# Altium project Banka.PrjPcb
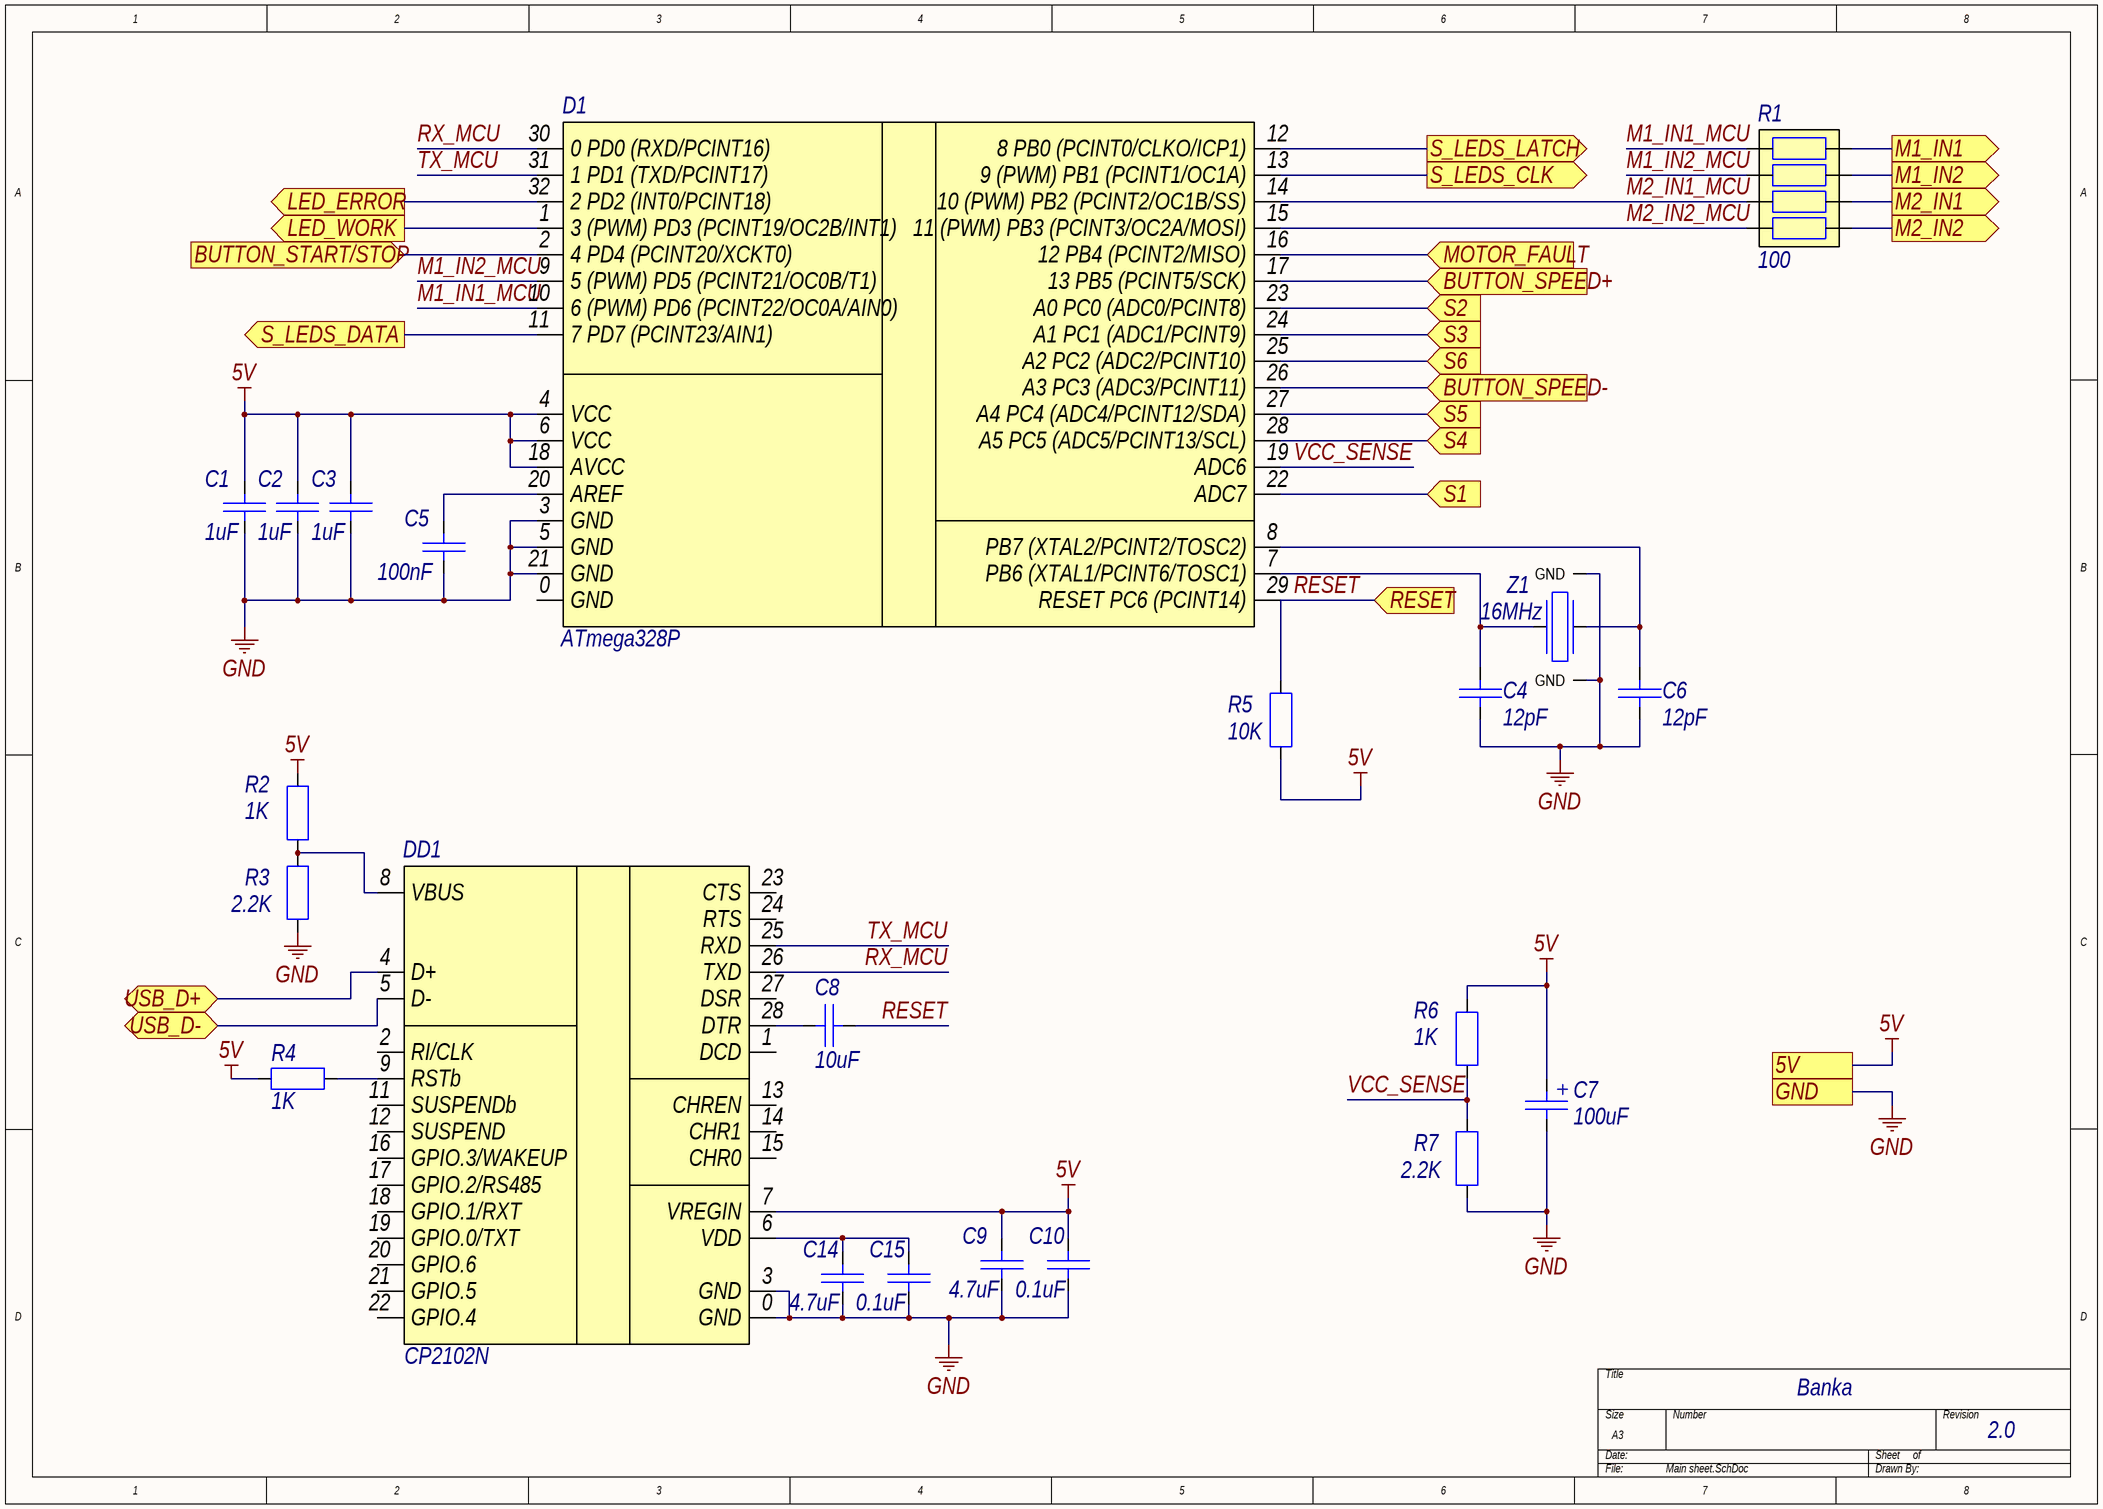
[diagram p0: Main sheet.SchDoc]
4 sheets, 87 parts. Net scope: flat (ports and power ports of the same name join across sheets).
Board file: Banka.PcbDoc
Sheets:
  Main sheet.SchDoc
  IO.SchDoc
  Sensors.SchDoc
  Motor driver.SchDoc

## Sheet Main sheet.SchDoc
size A3

### Parts
C1  1uF  [NPC0805]
C2  1uF  [NPC0805]
C3  1uF  [NPC0805]
C4  12pF  [NPC0805]
C5  100nF  [NPC0805]
C6  12pF  [NPC0805]
C7  100uF  [TANTAL CAPACITOR C]
C8  10uF  [NPC0805]
C9  4.7uF  [NPC0805]
C10  0.1uF  [NPC0805]
C14  4.7uF  [NPC0805]
C15  0.1uF  [NPC0805]
D1  ATmega328P  [TQFP32]
DD1  CP2102N  [QFN28 (5x5)]
R1  100  [CAT16]
R2  1K  [R0805]
R3  2.2K  [R0805]
R4  1K  [R0805]
R5  10K  [R0805]
R6  1K  [R0805]
R7  2.2K  [R0805]
Z1  16MHz  [KX-7T]

### Ports
5V, BUTTON_SPEED+ (in), BUTTON_SPEED- (in), BUTTON_START/STOP (in), GND, LED_ERROR (out), LED_WORK (out), M1_IN1 (out), M1_IN2 (out), M2_IN1 (out), M2_IN2 (out), MOTOR_FAULT (in), RESET (in), S1 (in), S2 (in), S3 (in), S4 (in), S5 (in), S6 (in), S_LEDS_CLK (out), S_LEDS_DATA (out), S_LEDS_LATCH (out), USB_D+ (bidir), USB_D- (bidir)

### Nets
5V: C1.2 C2.2 C3.2 C7.1 C9.2 C10.2 D1.4(VCC) D1.6(VCC) D1.18(AVCC) DD1.7(VREGIN) R2.2 R4.2 R5.1 R6.2 ; port 5V
GND: C1.1 C2.1 C3.1 C4.1 C5.1 C6.1 C7.2 C9.1 C10.1 C14.1 C15.1 D1.3(GND) D1.5(GND) D1.21(GND) DD1.0(GND) DD1.3(GND) R3.1 R7.1 Z1.3(GND) Z1.4(GND) ; port GND
BUTTON_SPEED+: D1.17(13_PB5_(PCINT5/SCK)) ; port BUTTON_SPEED+
BUTTON_SPEED-: D1.26(A3_PC3_(ADC3/PCINT11)) ; port BUTTON_SPEED-
BUTTON_START/STOP: D1.2(4_PD4_(PCINT20/XCKT0)) ; port BUTTON_START/STOP
LED_ERROR: D1.32(2_PD2_(INT0/PCINT18)) ; port LED_ERROR
LED_WORK: D1.1(3_(PWM)_PD3_(PCINT19/OC2B/INT1)) ; port LED_WORK
M1_IN1: R1.4 ; port M1_IN1
M1_IN1_MCU: D1.10(6_(PWM)_PD6_(PCINT22/OC0A/AIN0)) R1.5
M1_IN2: R1.3 ; port M1_IN2
M1_IN2_MCU: D1.9(5_(PWM)_PD5_(PCINT21/OC0B/T1)) R1.6
M2_IN1: R1.2 ; port M2_IN1
M2_IN1_MCU: D1.14(10_(PWM)_PB2_(PCINT2/OC1B/SS)) R1.7
M2_IN2: R1.1 ; port M2_IN2
M2_IN2_MCU: D1.15(11_(PWM)_PB3_(PCINT3/OC2A/MOSI)) R1.8
MOTOR_FAULT: D1.16(12_PB4_(PCINT2/MISO)) ; port MOTOR_FAULT
RESET: C8.1 D1.29(RESET_PC6_(PCINT14)) R5.2 ; port RESET
RX_MCU: D1.30(0_PD0_(RXD/PCINT16)) DD1.26(TXD)
S1: D1.22(ADC7) ; port S1
S2: D1.23(A0_PC0_(ADC0/PCINT8)) ; port S2
S3: D1.24(A1_PC1_(ADC1/PCINT9)) ; port S3
S4: D1.28(A5_PC5_(ADC5/PCINT13/SCL)) ; port S4
S5: D1.27(A4_PC4_(ADC4/PCINT12/SDA)) ; port S5
S6: D1.25(A2_PC2_(ADC2/PCINT10)) ; port S6
S_LEDS_CLK: D1.13(9_(PWM)_PB1_(PCINT1/OC1A)) ; port S_LEDS_CLK
S_LEDS_DATA: D1.11(7_PD7_(PCINT23/AIN1)) ; port S_LEDS_DATA
S_LEDS_LATCH: D1.12(8_PB0_(PCINT0/CLKO/ICP1)) ; port S_LEDS_LATCH
TX_MCU: D1.31(1_PD1_(TXD/PCINT17)) DD1.25(RXD)
USB_D+: DD1.4(D+) ; port USB_D+
USB_D-: DD1.5(D-) ; port USB_D-
VCC_SENSE: D1.19(ADC6) R6.1 R7.2
NetC4_2: C4.2 D1.7(PB6_(XTAL1/PCINT6/TOSC1)) Z1.1
NetC5_2: C5.2 D1.20(AREF)
NetC6_2: C6.2 D1.8(PB7_(XTAL2/PCINT2/TOSC2)) Z1.2
NetC8_2: C8.2 DD1.28(DTR)
NetC14_2: C14.2 C15.2 DD1.6(VDD)
NetDD1_8: DD1.8(VBUS) R2.1 R3.2
NetDD1_9: DD1.9(RSTb) R4.1

Not connected (* = marked no-connect by the designer): D1 0(GND); DD1 1(DCD) 2(RI/CLK) 11(SUSPENDb) 12(SUSPEND) 13(CHREN) 14(CHR1) 15(CHR0) 16(GPIO.3/WAKEUP) 17(GPIO.2/RS485) 18(GPIO.1/RXT) 19(GPIO.0/TXT) 20(GPIO.6) 21(GPIO.5) 22(GPIO.4) 23(CTS) 24(RTS) 27(DSR)

### Notes on the sheet
- Banka
- 2.0

### Library data of the parts
C1-C6 C8-C10 C14 C15 = Nonpolarized Capacitor: Nonpolarized Capacitor (Ceramic)
  C1-C3: Value: 1uF
  C4 C6: Value: 12pF
  C5: Value: 100nF
  C8: Value: 10uF
  C9 C14: Value: 4.7uF
  C10 C15: Value: 0.1uF
C7 = Polarized Capacitor: Polarized Capacitor (Electrolytic, tantalum); Value: 100uF
D1 = ATmega328P: AVR, 8-bit MCU, 20MHz, 32KB Flash
DD1 = CP2102N 28 pin: USB-UART converter
R1 = Resistor Array: Power rating: 0,05Вт; Value: 100
R2-R7 = Resistor: Power rating: 2Вт
  R2 R4 R6: Value: 1K
  R3 R7: Value: 2.2K
  R5: Value: 10K
Z1 = Quartz Crystal: Quartz oscillator; Manufacturer: Geyer Electronics; Tolerance: 30ppm; Temperature tolerance: 100ppm; Max. aging frequency at first year: +-2ppm; Name: KX-7T; Temperature range: -40...85C; Value: 16MHz; Package: SMD3,2x2,5x0,8

## Sheet IO.SchDoc
size A3
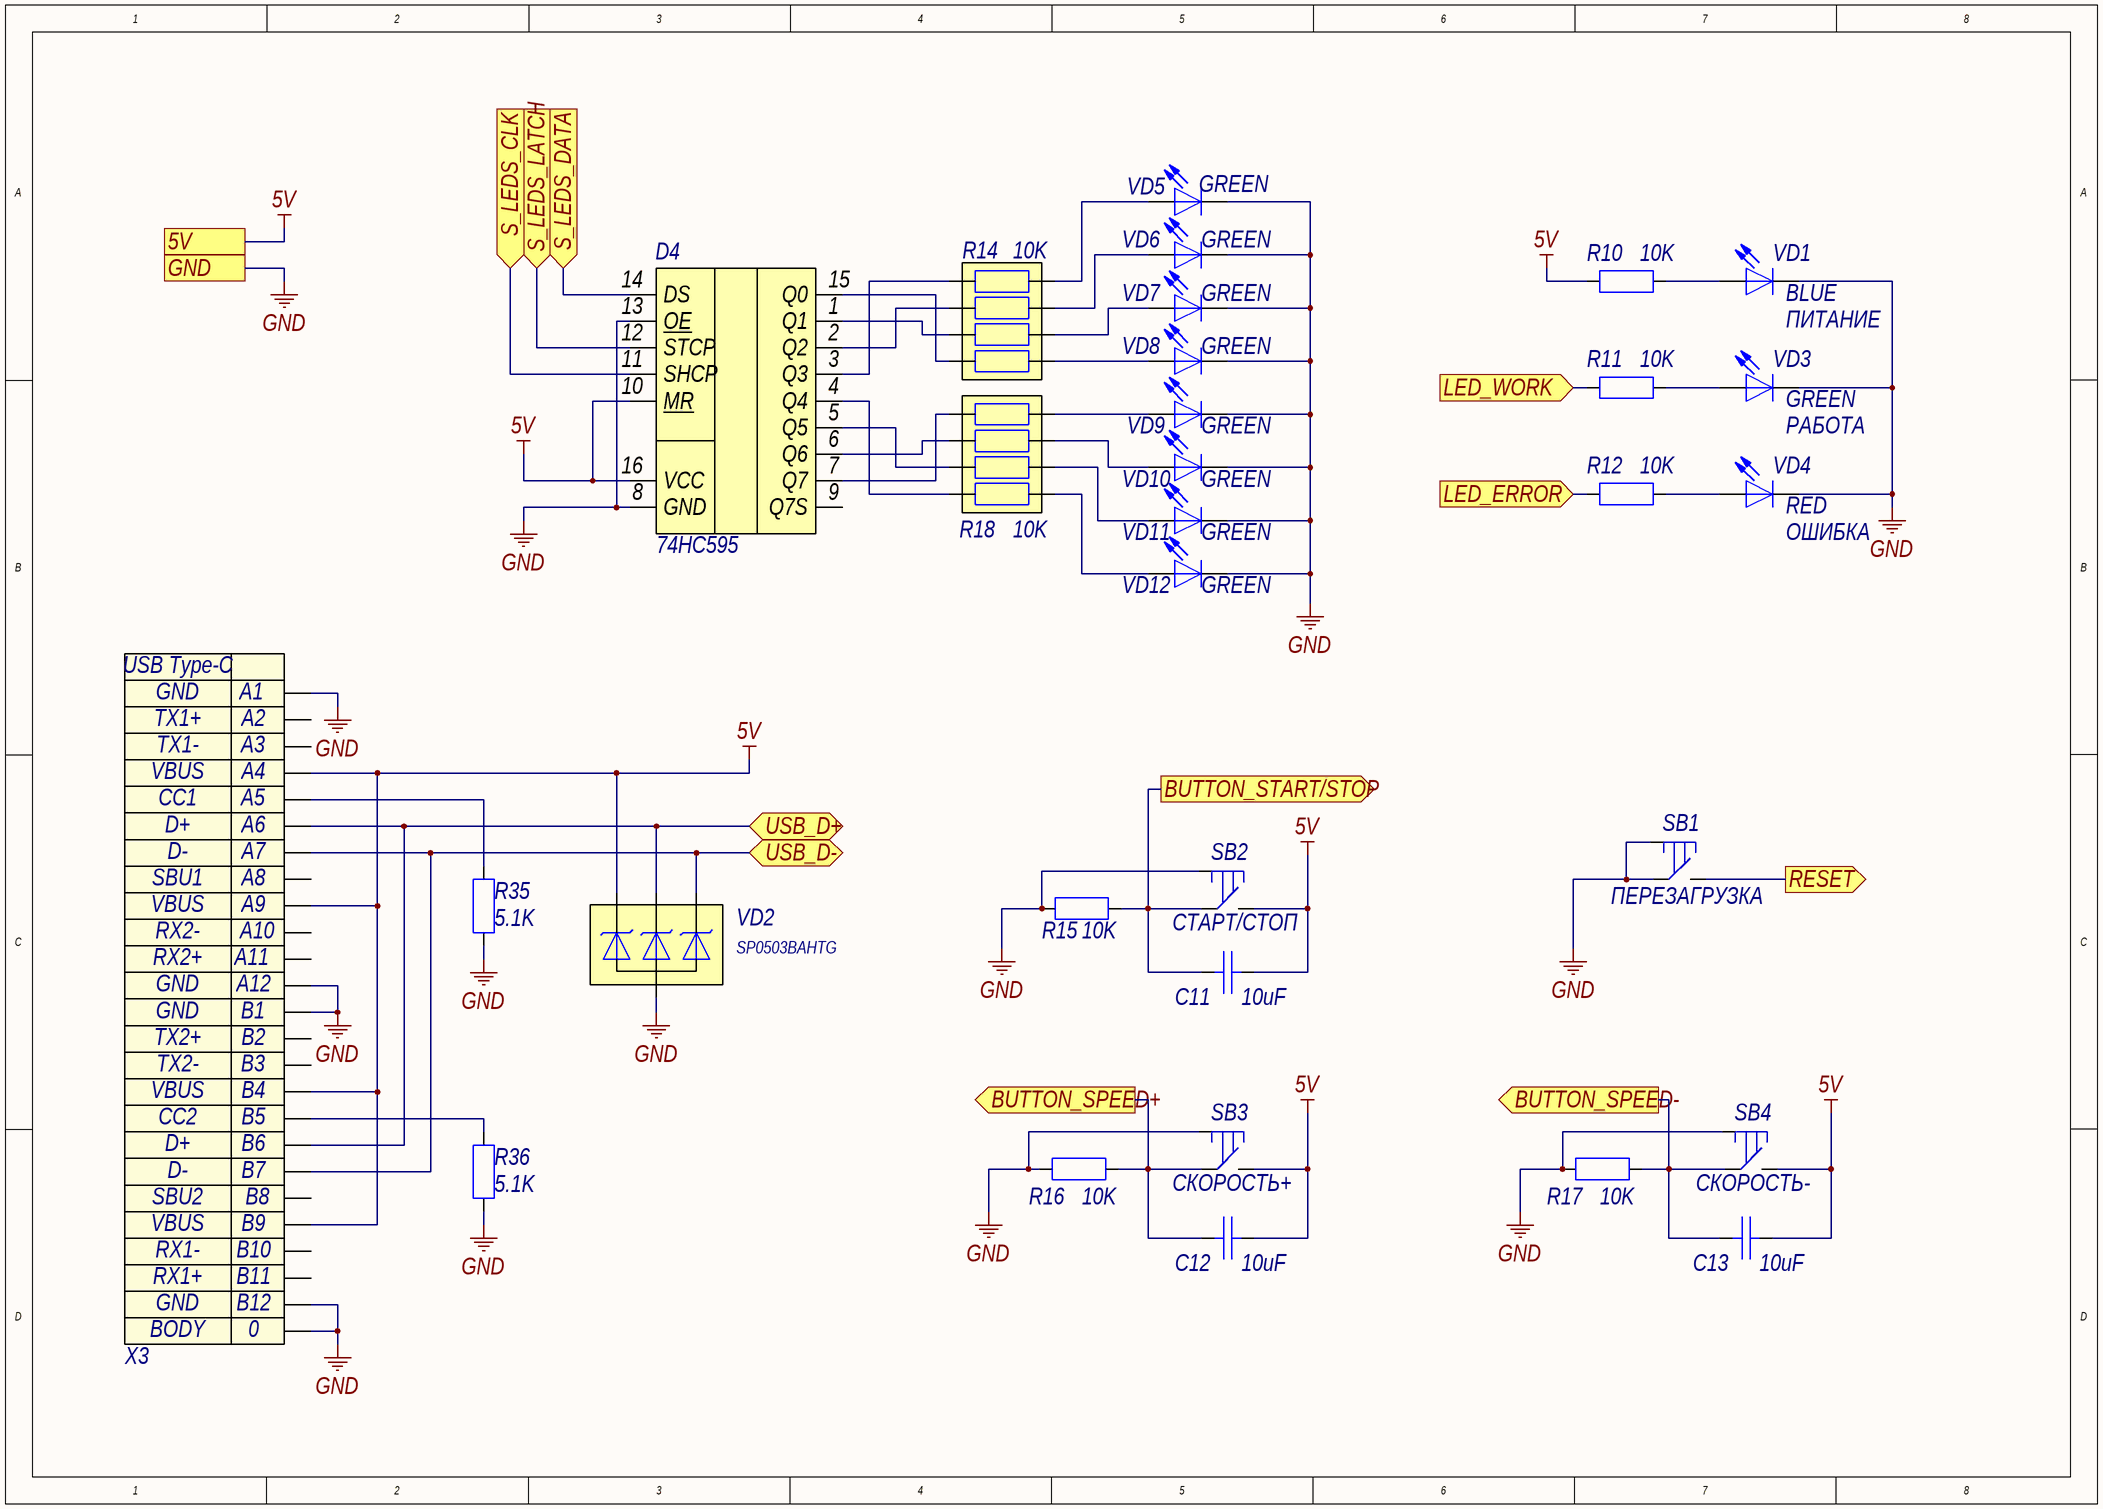
[diagram p1: IO.SchDoc]

### Parts
C11  10uF  [NPC0805]
C12  10uF  [NPC0805]
C13  10uF  [NPC0805]
D4  74HC595  [SOIC16]
R10  10K  [R0805]
R11  10K  [R0805]
R12  10K  [R0805]
R14  10K  [CAT16]
R15  10K  [R0805]
R16  10K  [R0805]
R17  10K  [R0805]
R18  10K  [CAT16]
R35  5.1K  [R0805]
R36  5.1K  [R0805]
SB1  Function: ПЕРЕЗАГРУЗКА  [1-1437565-6 WITH LABEL]
SB2  Function: СТАРТ/СТОП  [1-1437565-6 WITH LABEL]
SB3  Function: СКОРОСТЬ+  [1-1437565-6 WITH LABEL]
SB4  Function: СКОРОСТЬ-  [1-1437565-6 WITH LABEL]
VD1  Name: ПИТАНИЕ  Color: BLUE  [0805_LED _BLUE]
VD2  SP0503BAHTG  [SOT143]
VD3  Name: РАБОТА  Color: GREEN  [0805_LED _GREEN]
VD4  Name: ОШИБКА  Color: RED  [0805_LED _RED]
VD5  GREEN  [0805_LED _GREEN]
VD6  Color: GREEN  [0805_LED _GREEN]
VD7  Color: GREEN  [0805_LED _GREEN]
VD8  Color: GREEN  [0805_LED _GREEN]
VD9  Color: GREEN  [0805_LED _GREEN]
VD10  Color: GREEN  [0805_LED _GREEN]
VD11  Color: GREEN  [0805_LED _GREEN]
VD12  Color: GREEN  [0805_LED _GREEN]
X3  USB Type-C  [USB Type-C Vertical]  (value not drawn)

### Ports
5V, BUTTON_SPEED+ (out), BUTTON_SPEED- (out), BUTTON_START/STOP (out), GND, LED_ERROR (in), LED_WORK (in), RESET (out), S_LEDS_CLK (in), S_LEDS_DATA (in), S_LEDS_LATCH (in), USB_D+ (bidir), USB_D- (bidir)

### Nets
5V: C11.2 C12.2 C13.2 D4.10(MR) D4.16(VCC) R10.1 SB2.2 SB3.2 SB4.2 VD2.2(C) X3.A4 X3.A9 X3.B4 X3.B9 ; port 5V
GND: D4.8(GND) D4.13(OE) R15.1 R16.1 R17.1 R35.1 R36.1 SB1.1 SB1.3(GND) SB2.3(GND) SB3.3(GND) SB4.3(GND) VD1.1(K) VD2.1(A) VD3.1(K) VD4.1(K) VD5.1(K) VD6.1(K) VD7.1(K) VD8.1(K) VD9.1(K) VD10.1(K) VD11.1(K) VD12.1(K) X3.0 X3.A1 X3.A12 X3.B1 X3.B12 ; port GND
BUTTON_SPEED+: C12.1 R16.2 SB3.1 ; port BUTTON_SPEED+
BUTTON_SPEED-: C13.1 R17.2 SB4.1 ; port BUTTON_SPEED-
BUTTON_START/STOP: C11.1 R15.2 SB2.1 ; port BUTTON_START/STOP
LED_ERROR: R12.1 ; port LED_ERROR
LED_WORK: R11.1 ; port LED_WORK
RESET: SB1.2 ; port RESET
S_LEDS_CLK: D4.11(SHCP) ; port S_LEDS_CLK
S_LEDS_DATA: D4.14(DS) ; port S_LEDS_DATA
S_LEDS_LATCH: D4.12(STCP) ; port S_LEDS_LATCH
USB_D+: VD2.3(C) X3.A6 X3.B6 ; port USB_D+
USB_D-: VD2.4(C) X3.A7 X3.B7 ; port USB_D-
NetD4_1: D4.1(Q1) R14.3
NetD4_2: D4.2(Q2) R14.2
NetD4_3: D4.3(Q3) R14.1
NetD4_4: D4.4(Q4) R18.4
NetD4_5: D4.5(Q5) R18.3
NetD4_6: D4.6(Q6) R18.2
NetD4_7: D4.7(Q7) R18.1
NetD4_15: D4.15(Q0) R14.4
NetR10_2: R10.2 VD1.2(A)
NetR11_2: R11.2 VD3.2(A)
NetR12_2: R12.2 VD4.2(A)
NetR14_5: R14.5 VD8.2(A)
NetR14_6: R14.6 VD7.2(A)
NetR14_7: R14.7 VD6.2(A)
NetR14_8: R14.8 VD5.2(A)
NetR18_5: R18.5 VD12.2(A)
NetR18_6: R18.6 VD11.2(A)
NetR18_7: R18.7 VD10.2(A)
NetR18_8: R18.8 VD9.2(A)
NetR35_2: R35.2 X3.A5
NetR36_2: R36.2 X3.B5

Not connected (* = marked no-connect by the designer): D4 9(Q7S); X3 A2 A3 A8 A10 A11 B2 B3 B8 B10 B11

### Notes on the sheet
- (in symbol USB Type-C) GND; TX1+; TX1-; VBUS; CC1; D+; D-; SBU1; RX2-; RX2+; TX2+; TX2-; CC2; SBU2; RX1-; RX1+; BODY

### Library data of the parts
C11-C13 = Nonpolarized Capacitor: Nonpolarized Capacitor (Ceramic); Value: 10uF
D4 = 74HC595: Сдвиговый регистр, 8 каналов
R10-R12 R15-R17 R35 R36 = Resistor: Power rating: 2Вт
  R10-R12 R15-R17: Value: 10K
  R35 R36: Value: 5.1K
R14 R18 = Resistor Array: Power rating: 0,05Вт; Value: 10K
SB1-SB4 = Button_SMD: Кнопка без фиксации
VD1 VD3-VD12 = LED: Светодиод SMD; Manufacturer: KGB; Forward voltage; 25мА: 2,15В; Max. forward current (continuous): 25мА; Package: 0603
  VD5: Color: GREEN
VD2 = SP0503BAHTG: 3 TVS Diodes assembly, 5V
X3 = USB Type-C: USB Type-C connector

## Sheet Sensors.SchDoc
size A4
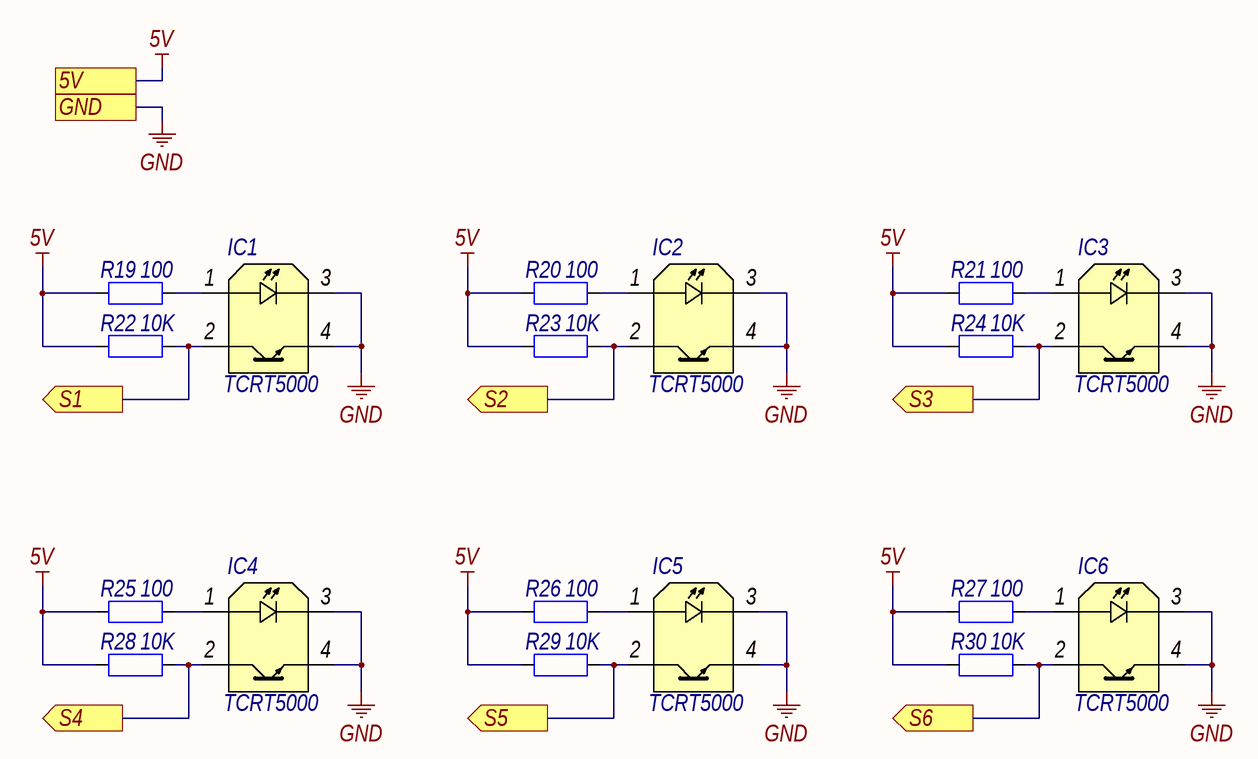
[diagram p2: Sensors.SchDoc]

### Parts
IC1  TCRT5000  [TCRT5000]
IC2  TCRT5000  [TCRT5000]
IC3  TCRT5000  [TCRT5000]
IC4  TCRT5000  [TCRT5000]
IC5  TCRT5000  [TCRT5000]
IC6  TCRT5000  [TCRT5000]
R19  100  [R0805]
R20  100  [R0805]
R21  100  [R0805]
R22  10K  [R0805]
R23  10K  [R0805]
R24  10K  [R0805]
R25  100  [R0805]
R26  100  [R0805]
R27  100  [R0805]
R28  10K  [R0805]
R29  10K  [R0805]
R30  10K  [R0805]

### Ports
5V, GND, S1 (out), S2 (out), S3 (out), S4 (out), S5 (out), S6 (out)

### Nets
5V: R19.2 R20.2 R21.2 R22.2 R23.2 R24.2 R25.2 R26.2 R27.2 R28.2 R29.2 R30.2 ; port 5V
GND: IC1.3(C) IC1.4(E) IC2.3(C) IC2.4(E) IC3.3(C) IC3.4(E) IC4.3(C) IC4.4(E) IC5.3(C) IC5.4(E) IC6.3(C) IC6.4(E) ; port GND
S1: IC1.2(C) R22.1 ; port S1
S2: IC2.2(C) R23.1 ; port S2
S3: IC3.2(C) R24.1 ; port S3
S4: IC4.2(C) R28.1 ; port S4
S5: IC5.2(C) R29.1 ; port S5
S6: IC6.2(C) R30.1 ; port S6
NetIC1_1: IC1.1(A) R19.1
NetIC2_1: IC2.1(A) R20.1
NetIC3_1: IC3.1(A) R21.1
NetIC4_1: IC4.1(A) R25.1
NetIC5_1: IC5.1(A) R26.1
NetIC6_1: IC6.1(A) R27.1

### Library data of the parts
IC1-IC6 = TCRT5000: IR photointerrupter
R19-R30 = Resistor: Power rating: 2Вт
  R19-R21 R25-R27: Value: 100
  R22-R24 R28-R30: Value: 10K

## Sheet Motor driver.SchDoc
size A4
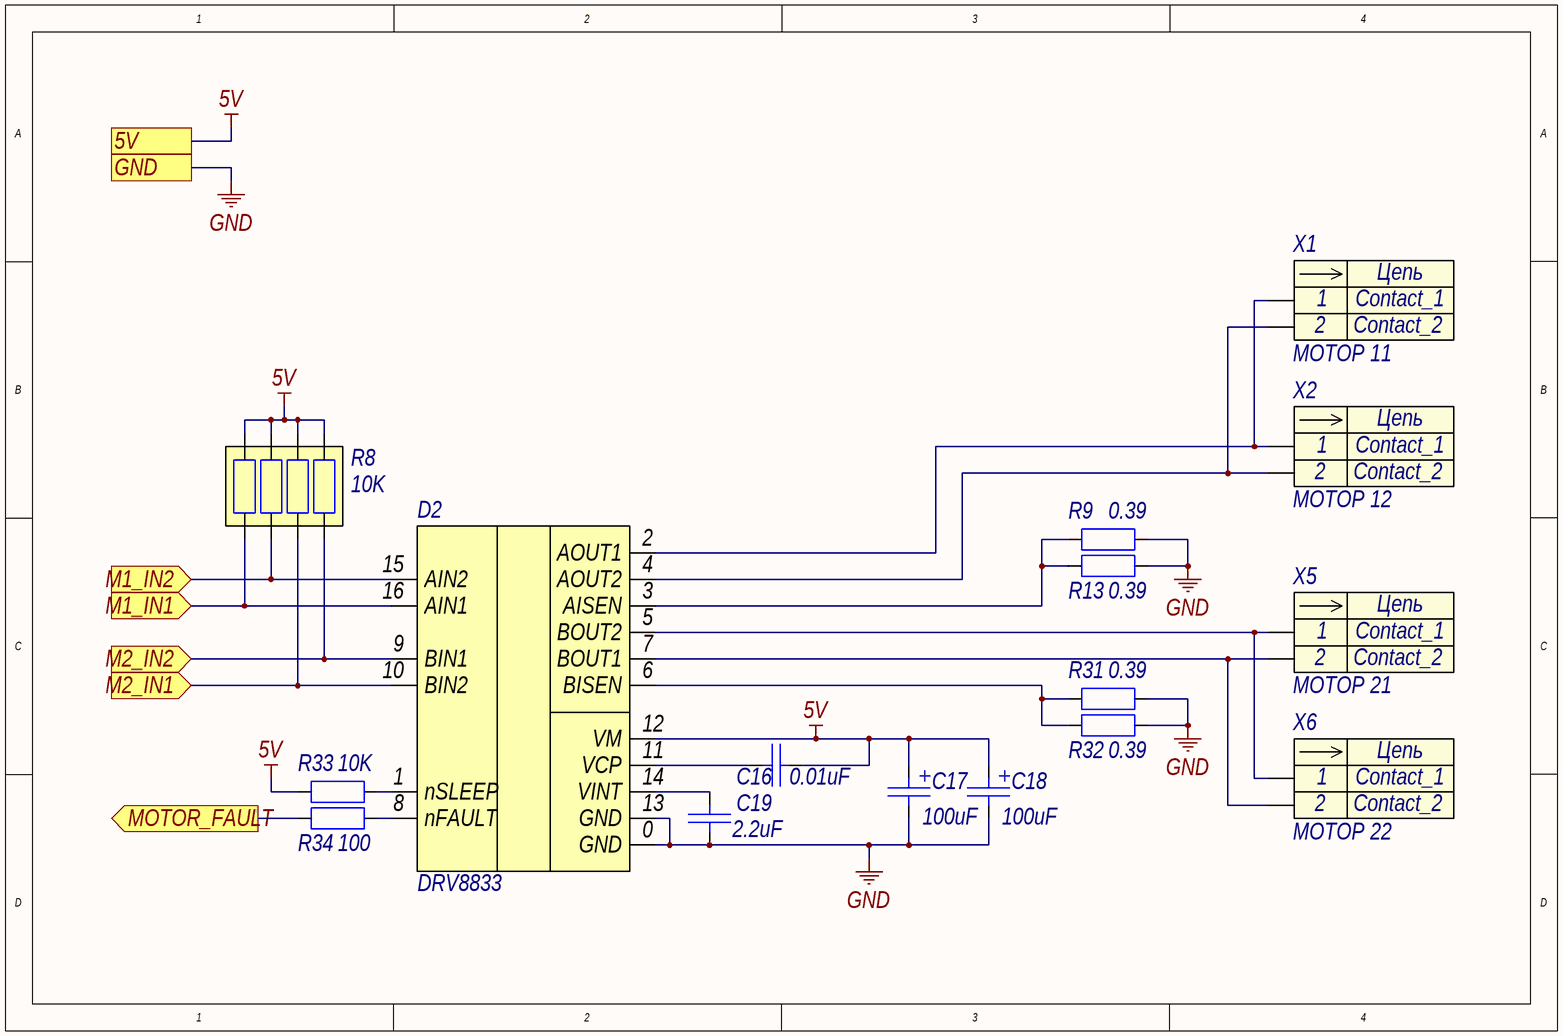
[diagram p3: Motor driver.SchDoc]

### Parts
C16  0.01uF  [NPC0805]
C17  100uF  [TANTAL CAPACITOR C]
C18  100uF  [TANTAL CAPACITOR C]
C19  2.2uF  [NPC0805]
D2  DRV8833  [TSSOP16]
R8  10K  [CAT16]
R9  0.39  [R2512]
R13  0.39  [R2512]
R31  0.39  [R2512]
R32  0.39  [R2512]
R33  10K  [R0805]
R34  100  [R0805]
X1  МОТОР 11  [KLS2-301-5.00 WITH LABEL]
X2  МОТОР 12  [KLS2-301-5.00 WITH LABEL]
X5  МОТОР 21  [KLS2-301-5.00 WITH LABEL]
X6  МОТОР 22  [KLS2-301-5.00 WITH LABEL]

### Ports
5V, GND, M1_IN1 (in), M1_IN2 (in), M2_IN1 (in), M2_IN2 (in), MOTOR_FAULT (out)

### Nets
5V: C16.1 C17.1 C18.1 D2.12(VM) R8.5 R8.6 R8.7 R8.8 R33.2 ; port 5V
GND: C17.2 C18.2 C19.1 D2.0(GND) D2.13(GND) R9.2 R13.2 R31.2 R32.2 ; port GND
M1_IN1: D2.16(AIN1) R8.1 ; port M1_IN1
M1_IN2: D2.15(AIN2) R8.2 ; port M1_IN2
M2_IN1: D2.10(BIN2) R8.3 ; port M2_IN1
M2_IN2: D2.9(BIN1) R8.4 ; port M2_IN2
MOTOR_FAULT: R34.2 ; port MOTOR_FAULT
NetC16_2: C16.2 D2.11(VCP)
NetC19_2: C19.2 D2.14(VINT)
NetD2_1: D2.1(nSLEEP) R33.1
NetD2_2: D2.2(AOUT1) X1.1 X2.1
NetD2_3: D2.3(AISEN) R9.1 R13.1
NetD2_4: D2.4(AOUT2) X1.2 X2.2
NetD2_5: D2.5(BOUT2) X5.1 X6.1
NetD2_6: D2.6(BISEN) R31.1 R32.1
NetD2_7: D2.7(BOUT1) X5.2 X6.2
NetD2_8: D2.8(nFAULT) R34.1

### Notes on the sheet
- (in symbol Header 2 pin) Цепь

### Library data of the parts
C16 C19 = Nonpolarized Capacitor: Nonpolarized Capacitor (Ceramic)
  C16: Value: 0.01uF
  C19: Value: 2.2uF
C17 C18 = Polarized Capacitor: as C7 on sheet Main sheet; Value: 100uF
D2 = DRV8833: DC motor driver, 2 channel,  2.7-10.8V, 1.5A
R8 = Resistor Array: Power rating: 0,05Вт; Value: 10K
R9 R13 R31-R34 = Resistor: Power rating: 2Вт
  R9 R13 R31 R32: Value: 0.39
  R33: Value: 10K
  R34: Value: 100
X1 X2 X5 X6 = Header 2 pin: Contact_1: Contact_1; Contact_2: Contact_2
  X1: Name: МОТОР 11
  X2: Name: МОТОР 12
  X5: Name: МОТОР 21
  X6: Name: МОТОР 22

## Nets that join several sheets
5V: Main sheet (14 pins), IO (14 pins), Sensors (12 pins), Motor driver (9 pins)
GND: Main sheet (20 pins), IO (29 pins), Sensors (12 pins), Motor driver (9 pins)
BUTTON_SPEED+: Main sheet (D1.17), IO (C12.1 R16.2 SB3.1)
BUTTON_SPEED-: Main sheet (D1.26), IO (C13.1 R17.2 SB4.1)
BUTTON_START/STOP: Main sheet (D1.2), IO (C11.1 R15.2 SB2.1)
LED_ERROR: Main sheet (D1.32), IO (R12.1)
LED_WORK: Main sheet (D1.1), IO (R11.1)
M1_IN1: Main sheet (R1.4), Motor driver (D2.16 R8.1)
M1_IN2: Main sheet (R1.3), Motor driver (D2.15 R8.2)
M2_IN1: Main sheet (R1.2), Motor driver (D2.10 R8.3)
M2_IN2: Main sheet (R1.1), Motor driver (D2.9 R8.4)
MOTOR_FAULT: Main sheet (D1.16), Motor driver (R34.2)
RESET: Main sheet (C8.1 D1.29 R5.2), IO (SB1.2)
S1: Main sheet (D1.22), Sensors (IC1.2 R22.1)
S2: Main sheet (D1.23), Sensors (IC2.2 R23.1)
S3: Main sheet (D1.24), Sensors (IC3.2 R24.1)
S4: Main sheet (D1.28), Sensors (IC4.2 R28.1)
S5: Main sheet (D1.27), Sensors (IC5.2 R29.1)
S6: Main sheet (D1.25), Sensors (IC6.2 R30.1)
S_LEDS_CLK: Main sheet (D1.13), IO (D4.11)
S_LEDS_DATA: Main sheet (D1.11), IO (D4.14)
S_LEDS_LATCH: Main sheet (D1.12), IO (D4.12)
USB_D+: Main sheet (DD1.4), IO (VD2.3 X3.A6 X3.B6)
USB_D-: Main sheet (DD1.5), IO (VD2.4 X3.A7 X3.B7)